# Altium schematic sheet power.SchDoc
size A; DocumentNumber: 1; SheetNumber: 1; SheetTotal: 6
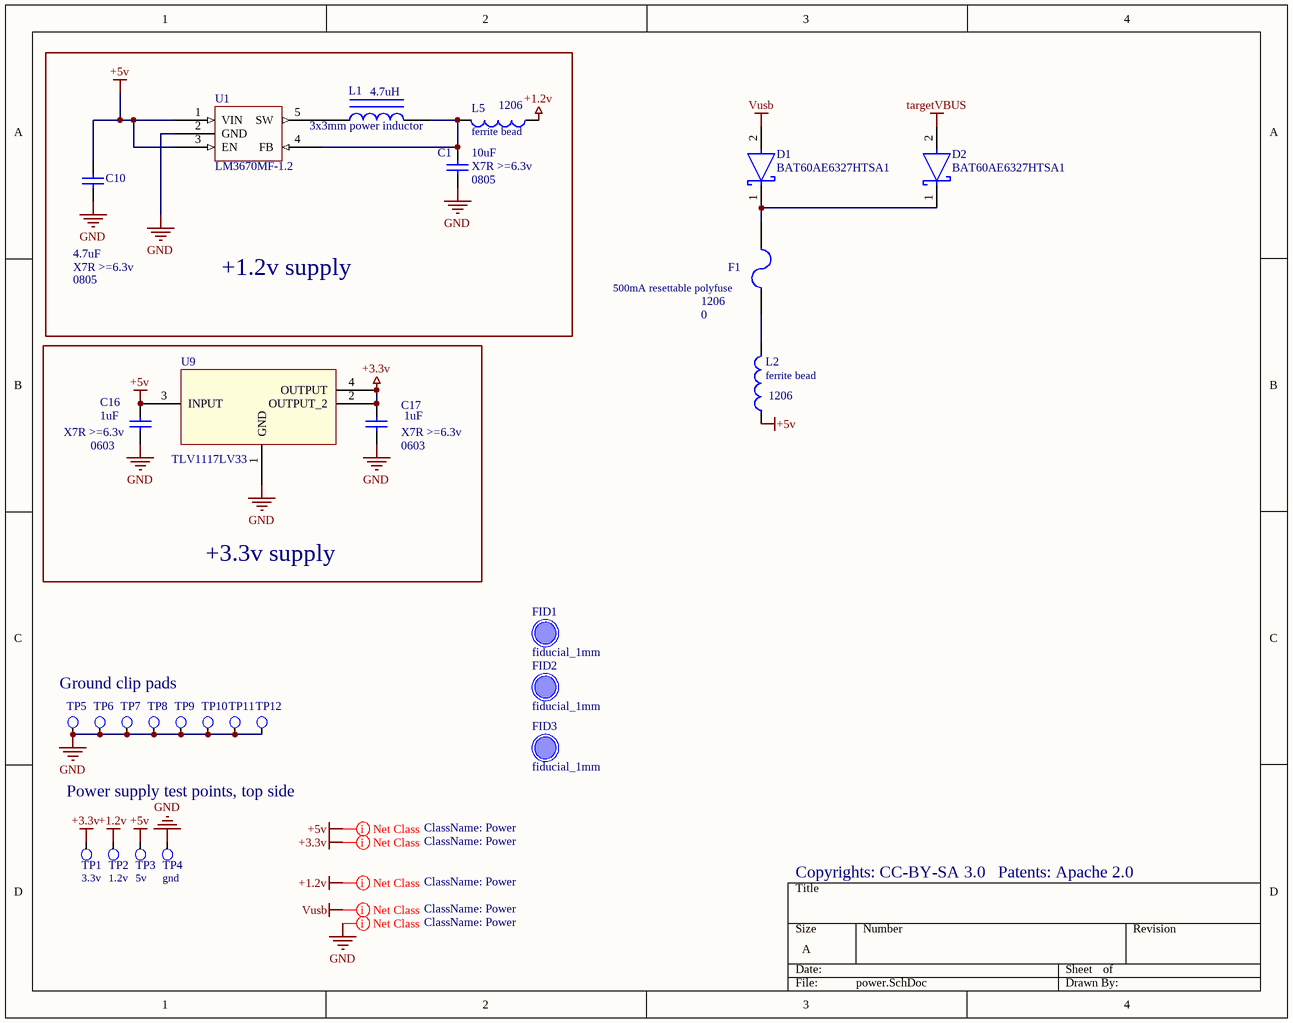
[diagram p0: power.SchDoc]

## Parts
C1  value 10uF  PackageReference: 0805  Rating: X7R >=6.3v  [CAPC2012N]  (hidden comment: Cap Semi)
C10  value 4.7uF  PackageReference: 0805  Rating: X7R >=6.3v  [CAPC2012N]  (hidden comment: Cap Semi)
C16  value 1uF  PackageReference: 0603  Rating: X7R >=6.3v  [CAPC1608N]  (hidden comment: Cap Semi)
C17  value 1uF  PackageReference: 0603  Rating: X7R >=6.3v  [CAPC1608N]  (hidden comment: Cap Semi)
D1  BAT60AE6327HTSA1  [FP-PG-SOD323-2-IPC_C]
D2  BAT60AE6327HTSA1  [FP-PG-SOD323-2-IPC_C]
F1  500mA resettable polyfuse  value 0  PackageReference: 1206  [RESC3216N]
FID1  fiducial_1mm  [Fiducial_1mm]
FID2  fiducial_1mm  [Fiducial_1mm]
FID3  fiducial_1mm  [Fiducial_1mm]
L1  3x3mm power inductor  value 4.7uH  [3x3mm inductor]
L2  ferrite bead  PackageReference: 1206  [INDC3216AN]
L5  ferrite bead  PackageReference: 1206  [INDC3216N]
TP1  3.3v  [testpoint-60mil]  (no BOM)
TP2  1.2v  [testpoint-60mil]  (no BOM)
TP3  5v  [testpoint-60mil]  (no BOM)
TP4  gnd  [testpoint-60mil]  (no BOM)
TP5  (no value)  [ground pad]  (no BOM)
TP6  (no value)  [ground pad]  (no BOM)
TP7  (no value)  [ground pad]  (no BOM)
TP8  (no value)  [ground pad]  (no BOM)
TP9  (no value)  [ground pad]  (no BOM)
TP10  (no value)  [ground pad]  (no BOM)
TP11  (no value)  [ground pad]  (no BOM)
TP12  (no value)  [ground pad]  (no BOM)
U1  value LM3670MF-1.2  [SOT23-5AN]  (hidden comment: LM3670MF-1.2/NOPB)
U9  TLV1117LV33  [DCY4]

## Blocks framed on the sheet
+1.2v supply: C1 C10 L1 L5 U1
+3.3v supply: C16 C17 U9

## Nets
+1.2v: L5.1 TP2.1(pin)
+3.3v: C17.2 TP1.1(pin) U9.2(OUTPUT_2) U9.4(OUTPUT)
+5v: C10.2 C16.2 L2.1 TP3.1(pin) U1.1(VIN) U1.3(EN) U9.3(INPUT)
GND: C1.1 C10.1 C16.1 C17.1 TP4.1(pin) TP5.1(pin) TP6.1(pin) TP7.1(pin) TP8.1(pin) TP9.1(pin) TP10.1(pin) TP11.1(pin) TP12.1(pin) U1.2(GND) U9.1(GND)
targetVBUS: D2.2(A)
Vusb: D1.2(A)
NetC1_2: C1.2 L1.2 L5.2 U1.4(FB)
NetD1_1: D1.1(C) D2.1(C) F1.1
NetF1_2: F1.2 L2.2
NetL1_1: L1.1 U1.5(SW)

## Layout directives
net class Power: +1.2v, +3.3v, +5v, GND, Vusb

## Notes on the sheet
- Ground clip pads
- Power supply test points, top side
- Copyrights: CC-BY-SA 3.0
- Patents: Apache 2.0
- Labels drawn without touching a wire or pin: +1.2v, +3.3v, +5v, GND, Vusb

## Library data of the parts
C1 = Cap Semi: Capacitor (Semiconductor SIM Model); Tolerance: ±10%; Substitutable: yes; Supplier 1: Mouser; Supplier Part Number 1: 81-GRM21BR61A106KE19
C10 = Cap: Capacitor; Tolerance: -20%, +80%; Substitutable: yes; Supplier 1: Digi-Key; Supplier Part Number 1: 445-1370-1-ND
C16 C17 = Cap Semi: Capacitor (Semiconductor SIM Model); Substitutable: yes; Supplier 1: Digi-Key; Supplier Part Number 1: 445-4703-1-ND
D1 D2 = CMP-32890-000004-1: DIODE SCHOTTKY 10V 3A SOD323-2; Forward Voltage: 370mV; Polarity: Standard; Peak Non-Repetitive Surge Current: 5A; Element Configuration: Single; Max Operating Temperature: 85°C; Current Rating: 3A; Number of Pins: 2; Mount: Surface Mount; Forward Current: 3A; Max Reverse Voltage (DC): 10V; Output Current: 3A; Contact Plating: Tin; Average Rectified Current: 3A; Lead Free: Lead Free; Max Repetitive Reverse Voltage (Vrrm): 10V; Voltage Rating (DC): 10V; Radiation Hardening: No; Halogen Free: Not Halogen Free; Case/Package: SOD-323-2; REACH SVHC: No SVHC; Min Operating Temperature: -55°C; Packaging: Tape and Reel
F1 = Fuse 2: Fuse; Substitutable: yes; Supplier 1: Mouser; Supplier Part Number 1: 576-1206L050YR
L1 = Inductor Iron: Magnetic-Core Inductor; Substitutable: yes; PackageReference: AXIAL-0.9; Supplier 1: Mouser; Supplier Part Number 1: 652-SRN3015-4R7M
L2 L5 = Inductor: VALUE: 0; Substitutable: yes; Supplier 1: Mouser; Supplier Part Number 1: 81-BLM18KG121TN1D
TP1-TP12 = Test Pad: PCB test point; Substitutable: DNP
U1 = LM3670: LM3670 buck step-down regulator, 350 mA; Substitutable: no; Supplier 1: Mouser; Supplier Part Number 1: 926-LM3670MF33NOPB; PackageReference: SOT23-5
U9 = TLV1117: Substitutable: no; Supplier 1: Digi-Key; Supplier Part Number 1: 296-28778-1-ND; PackageReference: SOT-223; Value: TLV1117LV33